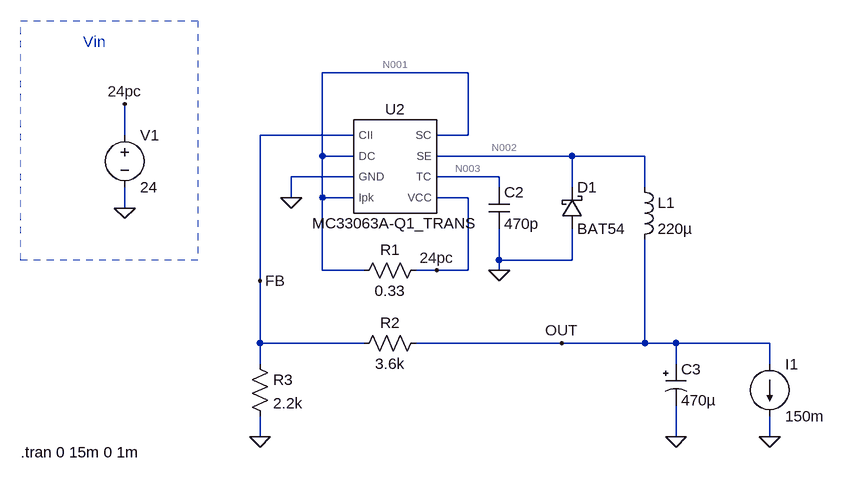
[diagram p0: schematic Housekeeping Power.asc]
Housekeeping Power.asc, the LTspice schematic file:
Version 4.1
SHEET 1 1056 704
WIRE 320 0 96 0
WIRE -208 96 -208 48
WIRE 144 96 0 96
WIRE 320 96 320 0
WIRE 320 96 272 96
WIRE 96 128 96 0
WIRE 144 128 96 128
WIRE 480 128 272 128
WIRE 592 128 480 128
WIRE 144 160 48 160
WIRE 368 160 272 160
WIRE 368 176 368 160
WIRE 480 176 480 128
WIRE 592 176 592 128
WIRE 48 192 48 160
WIRE 96 192 96 128
WIRE 144 192 96 192
WIRE 320 192 272 192
WIRE -208 208 -208 176
WIRE 368 288 368 240
WIRE 480 288 480 240
WIRE 480 288 368 288
WIRE 96 304 96 192
WIRE 160 304 96 304
WIRE 272 304 240 304
WIRE 320 304 320 192
WIRE 320 304 272 304
WIRE 368 304 368 288
WIRE 0 320 0 96
WIRE 0 416 0 320
WIRE 160 416 0 416
WIRE 464 416 240 416
WIRE 592 416 592 256
WIRE 592 416 464 416
WIRE 640 416 592 416
WIRE 784 416 640 416
WIRE 0 448 0 416
WIRE 640 448 640 416
WIRE 784 448 784 416
WIRE 0 560 0 528
WIRE 640 560 640 512
WIRE 784 560 784 528
FLAG -208 208 0
FLAG -208 48 24pc
FLAG 368 304 0
FLAG 272 304 24pc
FLAG 0 560 0
FLAG 640 560 0
FLAG 48 192 0
FLAG 784 560 0
FLAG 0 320 FB
FLAG 464 416 OUT
SYMBOL res 144 320 R270
WINDOW 0 32 56 VTop 2
WINDOW 3 0 56 VBottom 2
SYMATTR InstName R1
SYMATTR Value 0.33
SYMBOL cap 352 176 R0
SYMATTR InstName C2
SYMATTR Value 470p
SYMBOL schottky 464 240 M180
WINDOW 0 24 64 Left 2
WINDOW 3 24 0 Left 2
SYMATTR InstName D1
SYMATTR Value BAT54
SYMATTR Description Diode
SYMATTR Type diode
SYMBOL ind 576 160 R0
SYMATTR InstName L1
SYMATTR Value 220µ
SYMBOL res 256 400 R90
WINDOW 0 0 56 VBottom 2
WINDOW 3 32 56 VTop 2
SYMATTR InstName R2
SYMATTR Value 3.6k
SYMBOL res -16 432 R0
SYMATTR InstName R3
SYMATTR Value 2.2k
SYMBOL polcap 624 448 R0
SYMATTR InstName C3
SYMATTR Value 470µ
SYMBOL voltage -208 80 R0
WINDOW 123 0 0 Left 0
WINDOW 39 0 0 Left 0
SYMATTR InstName V1
SYMATTR Value 24
SYMBOL MC33063A-Q1_TRANS 208 144 R0
SYMATTR InstName U2
SYMBOL current 784 448 R0
WINDOW 123 0 0 Left 0
WINDOW 39 0 0 Left 0
SYMATTR InstName I1
SYMATTR Value 150m
TEXT -272 -48 Left 2 ;Vin
TEXT -368 584 Left 2 !.tran 0 15m 0 1m
LINE Normal -368 288 -368 -80 2
LINE Normal -96 288 -368 288 2
LINE Normal -96 -80 -96 288 2
LINE Normal -368 -80 -96 -80 2

The netlist it stands for:
* Housekeeping Power.asc
R1 N001 24pc 0.33
C2 N003 0 470p
D1 0 N002 BAT54
L1 N002 OUT 220µ
R2 OUT FB 3.6k
R3 FB 0 2.2k
C3 OUT 0 470µ
V1 24pc 0 24
X§U2 FB N001 0 N001 N001 N002 N003 24pc MC33063A-Q1_TRANS  ; pins CII DC GND Ipk SC SE TC VCC
I1 OUT 0 150m
.model D D
.lib standard.dio
* Vin
.tran 0 15m 0 1m
.lib ".\libraries\MC33063A-Q1_TRANS.lib"
.backanno
.end

* Results of the author's LTspice run, read from the files saved beside the schematic
* Operating Point, zero values left out:
*   V(24pc) = 24 V
*   V(n002) = -697.5 mV
*   V(out) = -697.7 mV
*   V(n001) = 24 V
*   V(n003) = -67.51 mV
*   V(fb) = -264.6 mV
*   I(R2) = -120.3 µA
*   I(R3) = -120.3 µA
*   I(V1) = -49.38 pA
*   I(R1) = -49.39 pA
*   I(D1) = 149.9 mA
*   I(I1) = 150 mA
*   I(L1) = 149.9 mA
*   Ix(u2:dc) = 24.73 pA
*   Ix(u2:sc) = 24.7 pA
*   Ix(u2:se) = -49.4 pA